# EasyEDA schematic Prática-14.json
TITLE: Sheet_1; REV: 1.0; Date: 2020-12-01; Sheet: 1/1; Drawn By: mrrbcc; Company: Your Company
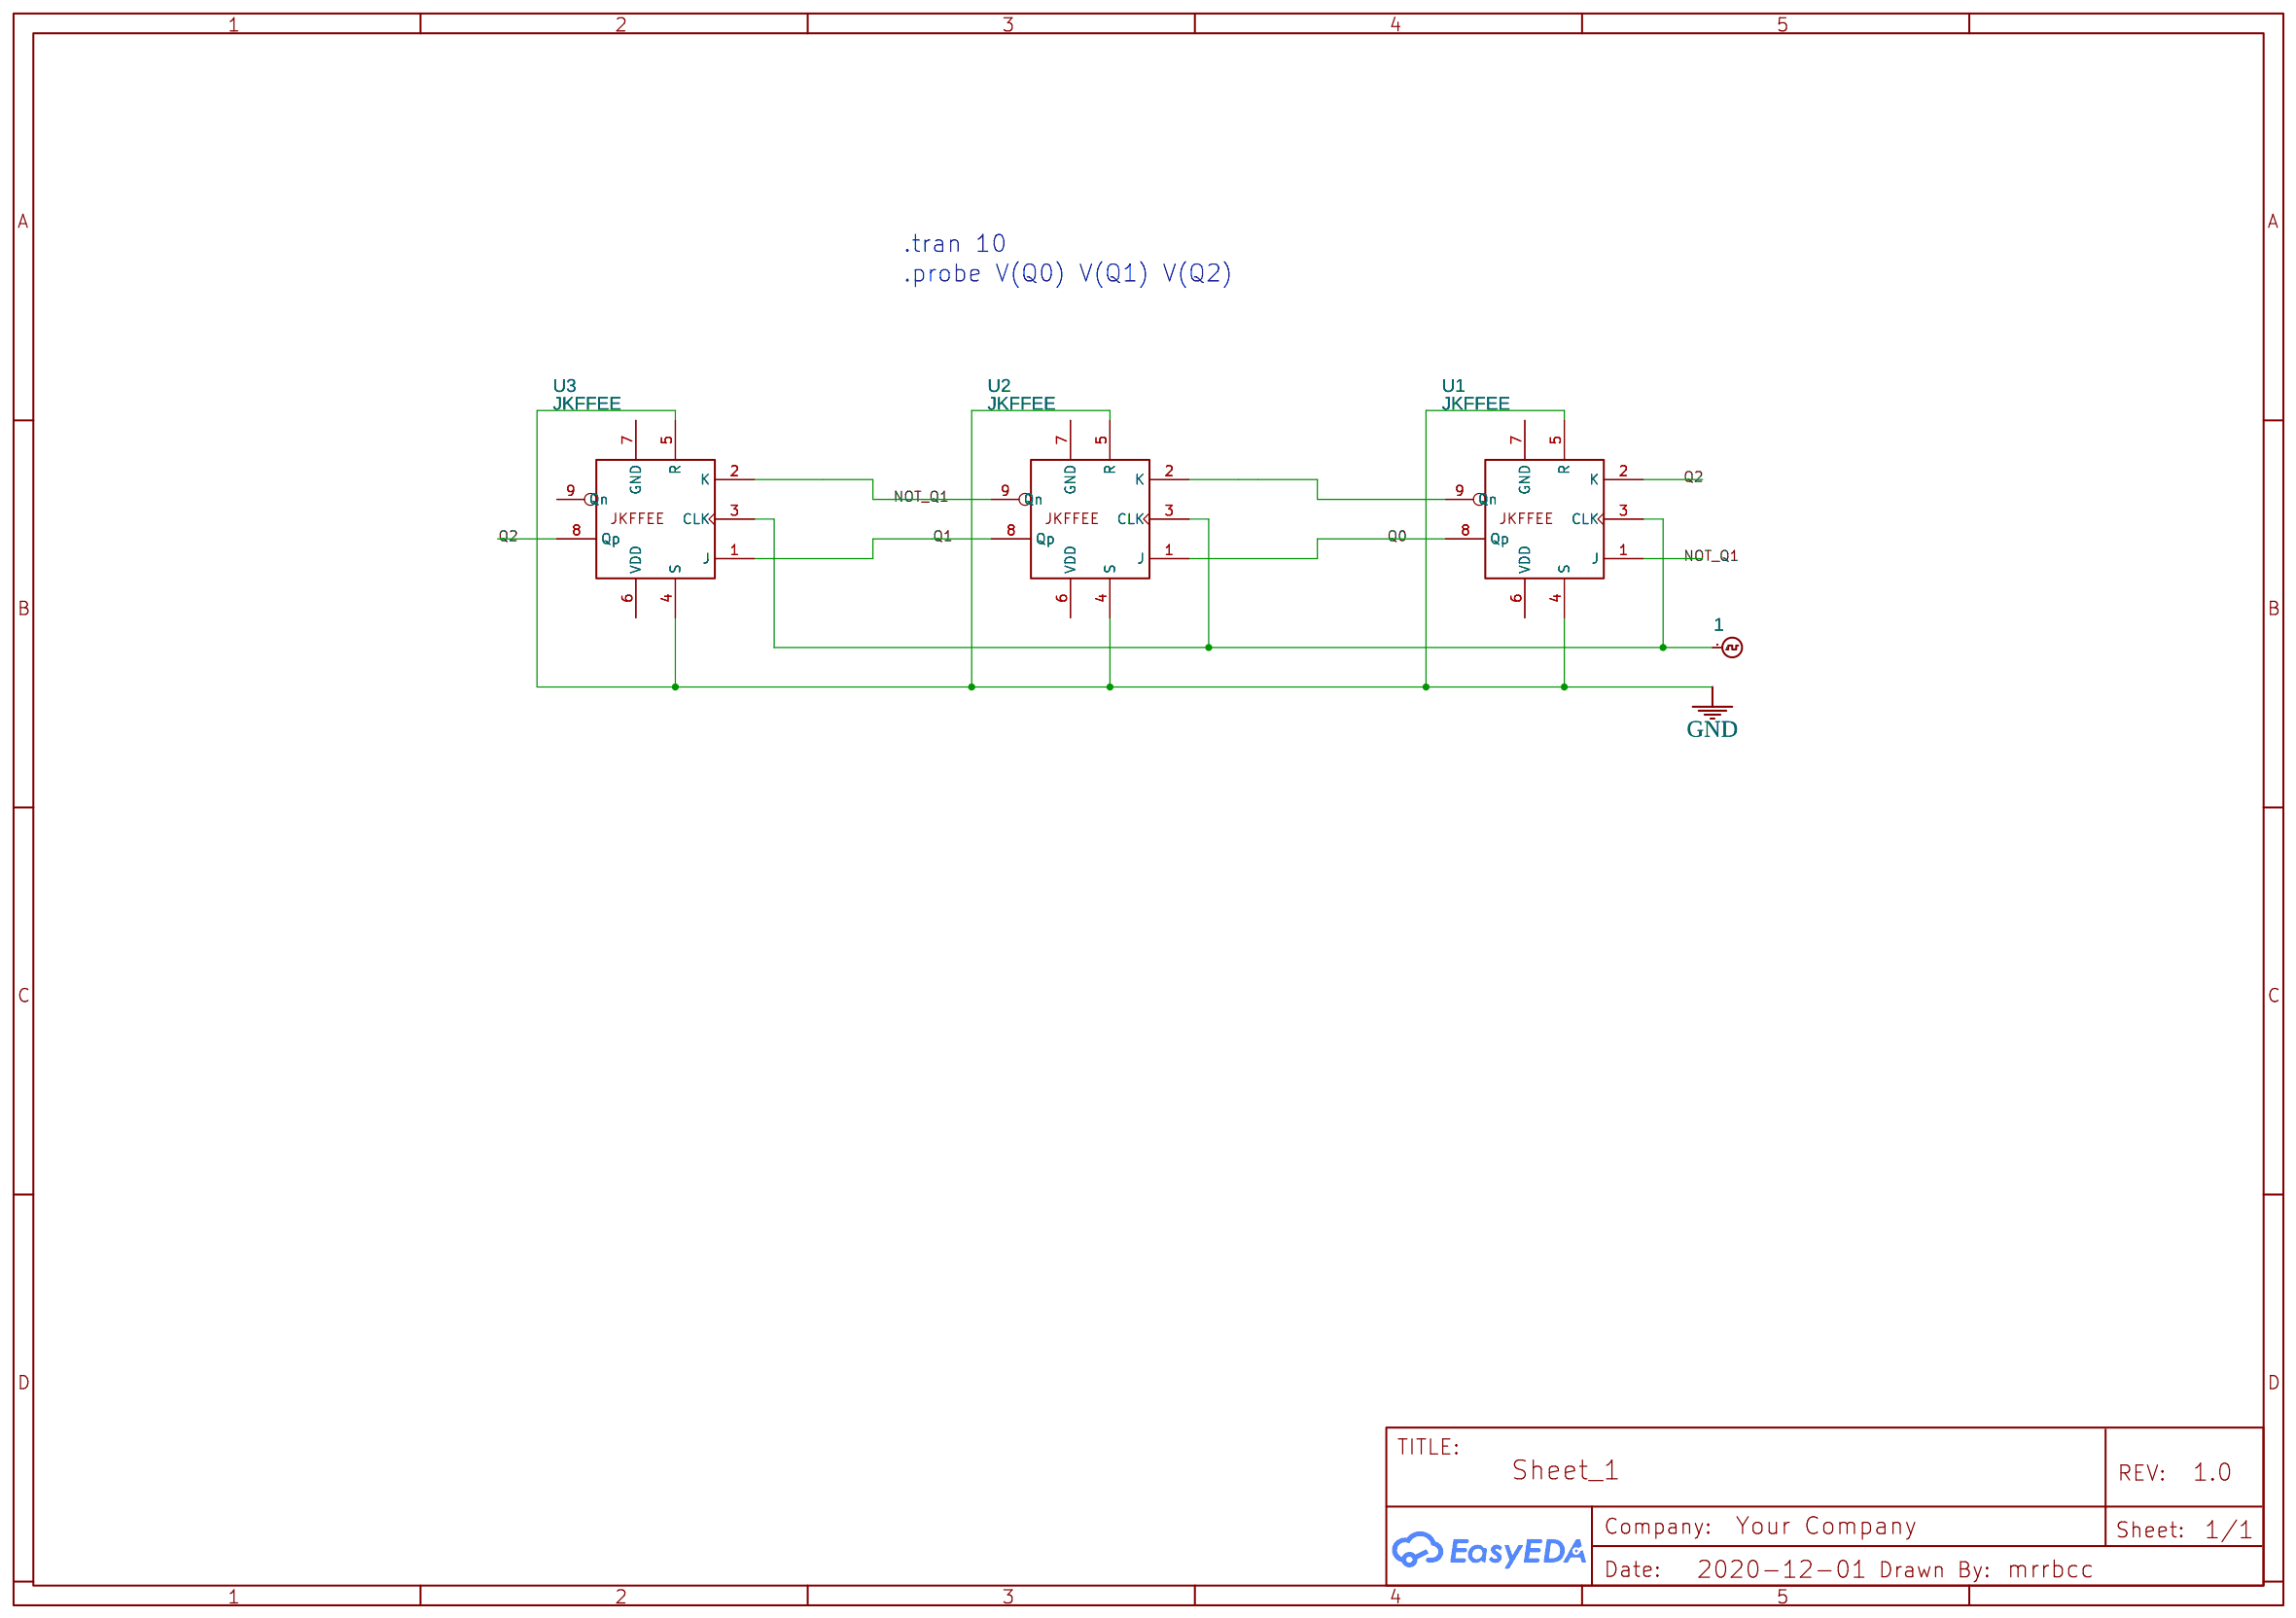
[diagram p0: schematic sheet]

## Parts
U1  JKFFEE
U2  JKFFEE
U3  JKFFEE
U4  1

## Library data of the parts
U1-U3 = LOGIC: Contributor: EasyEDA; sourceId: 8C82kBTN5; Supplier: YUJING
U4 = DIGITALCLOCK: Contributor: EasyEDA; PreDisplay: 0

## Nets
GND: U1.4(S) U1.5(R) U2.4(S) U2.5(R) U3.4(S) U3.5(R)
NOT_Q1: U1.1(J) U2.9(Qn) U3.2(K)
Q0: U1.8(Qp) U2.1(J)
Q1: U2.8(Qp) U3.1(J)
Q2: U1.2(K) U3.8(Qp)
Net-(U1-3): U1.3(CLK) U2.3(CLK) U3.3(CLK) U4.1
Net-(U1-9): U1.9(Qn) U2.2(K)

Not connected (* = marked no-connect by the designer): U1 6(VDD) 7(GND); U2 6(VDD) 7(GND); U3 6(VDD) 7(GND) 9(Qn)

## Notes on the sheet
- .tran 10
- .probe V(Q0) V(Q1) V(Q2)
